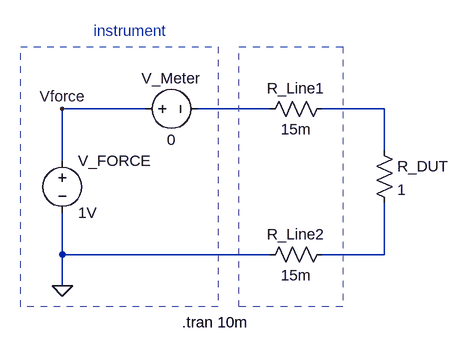
[diagram p0: schematic FVMI_mode_2wire_measureResistance.asc]
FVMI_mode_2wire_measureResistance.asc, the LTspice schematic file:
Version 4
SHEET 1 880 680
WIRE 0 80 -128 80
WIRE 192 80 80 80
WIRE 368 80 272 80
WIRE 368 144 368 80
WIRE -128 160 -128 80
WIRE -128 304 -128 240
WIRE 192 304 -128 304
WIRE 368 304 368 224
WIRE 368 304 272 304
WIRE -128 352 -128 304
FLAG -128 352 0
FLAG -128 80 Vforce
SYMBOL voltage -128 144 R0
SYMATTR InstName V_FORCE
SYMATTR Value 1V
SYMBOL voltage -16 80 R270
WINDOW 0 32 56 VTop 2
WINDOW 3 -32 56 VBottom 2
SYMATTR InstName V_Meter
SYMATTR Value 0
SYMBOL res 176 96 R270
WINDOW 0 32 56 VTop 2
WINDOW 3 0 56 VBottom 2
SYMATTR InstName R_Line1
SYMATTR Value 15m
SYMBOL res 176 320 R270
WINDOW 0 32 56 VTop 2
WINDOW 3 0 56 VBottom 2
SYMATTR InstName R_Line2
SYMATTR Value 15m
SYMBOL res 352 128 R0
SYMATTR InstName R_DUT
SYMATTR Value 1
TEXT 56 408 Left 2 !.tran 10m
TEXT -80 -40 Left 2 ;instrument
RECTANGLE Normal -192 -16 112 384 2
RECTANGLE Normal 144 -16 304 384 2

The netlist it stands for:
* FVMI_mode_2wire_measureResistance.asc
V_FORCE Vforce 0 1V
V_Meter Vforce N001 0
R_Line1 N001 N002 15m
R_Line2 0 N003 15m
R_DUT N002 N003 1
.tran 10m
* instrument
.backanno
.end